# Altium schematic sheet zbook-rf-shields-LORA-P1.SchDoc
size A4; DocumentNumber: 6; SheetNumber: 6; SheetTotal: 6
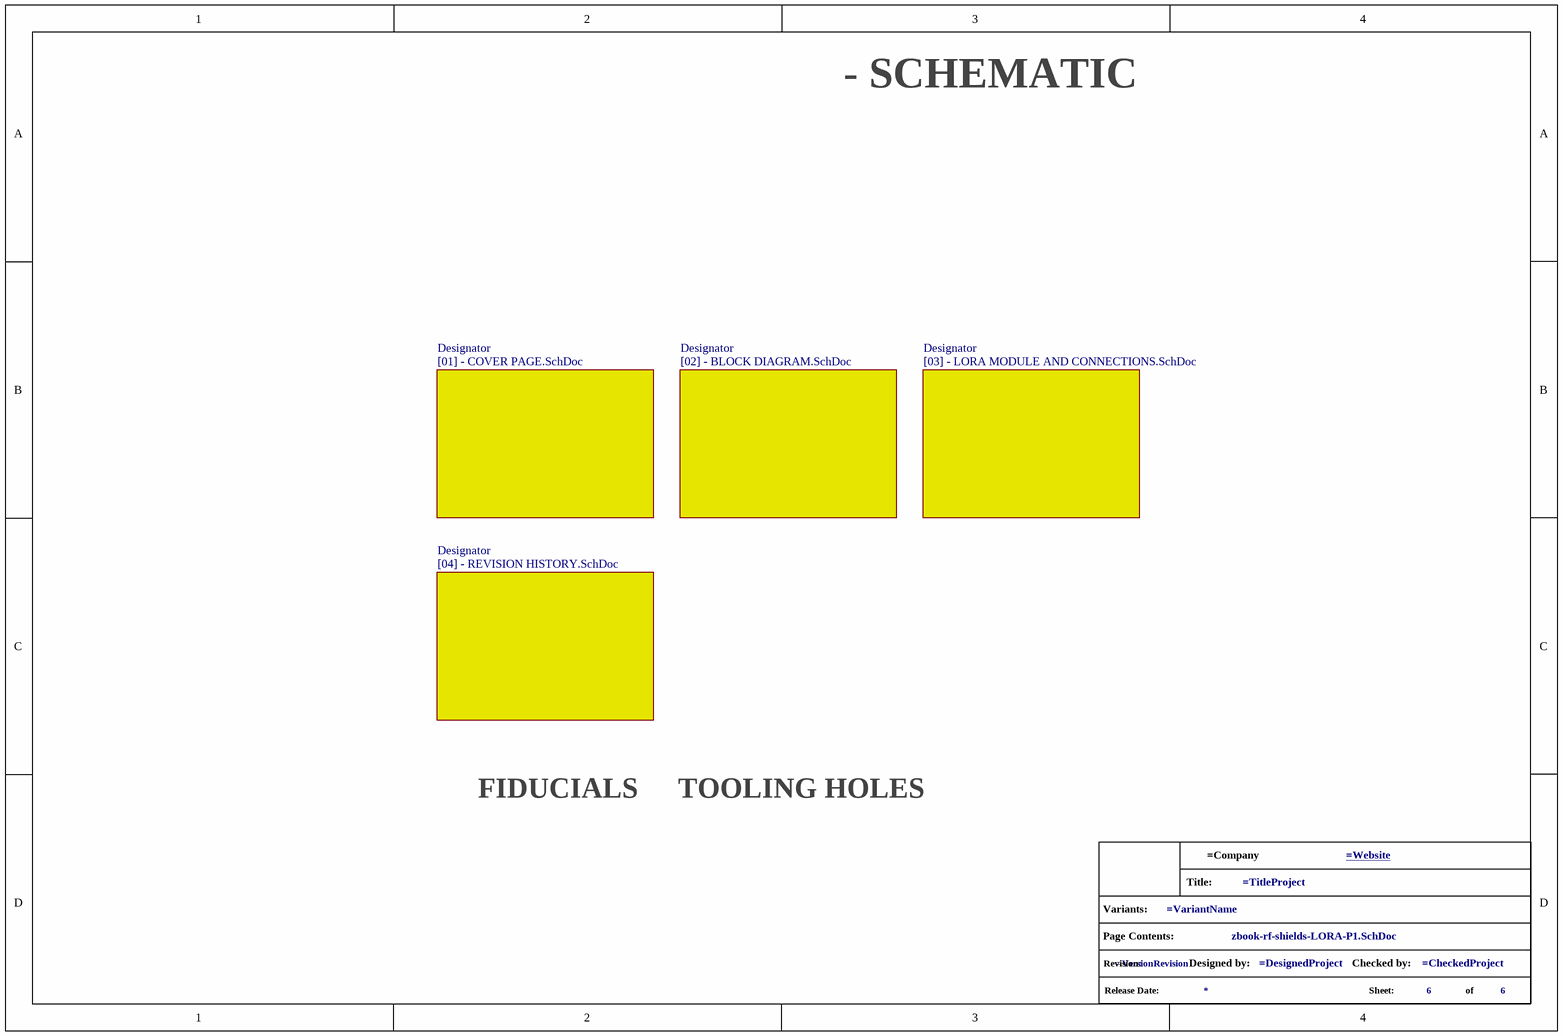
[diagram p0: zbook-rf-shields-LORA-P1.SchDoc]

## Parts
*?  info_project  (value not drawn)  (graphical)

## Sub-sheets
Designator = [02] - BLOCK DIAGRAM.SchDoc: no entries
Designator = [03] - LORA MODULE AND CONNECTIONS.SchDoc: no entries
Designator = [01] - COVER PAGE.SchDoc: no entries
Designator = [04] - REVISION HISTORY.SchDoc: no entries

## Notes on the sheet
- - SCHEMATIC
- FIDUCIALS
- TOOLING HOLES
- (in symbol info_project) Title:; Variants:; Page Contents:; Revision:; Designed by:; Checked by:; Release Date:; Sheet:; of

## Library data of the parts
*? = info_project: GRAPHICAL - Info Project